# Altium project DB-X01.PrjPcb (part 1 of 5)
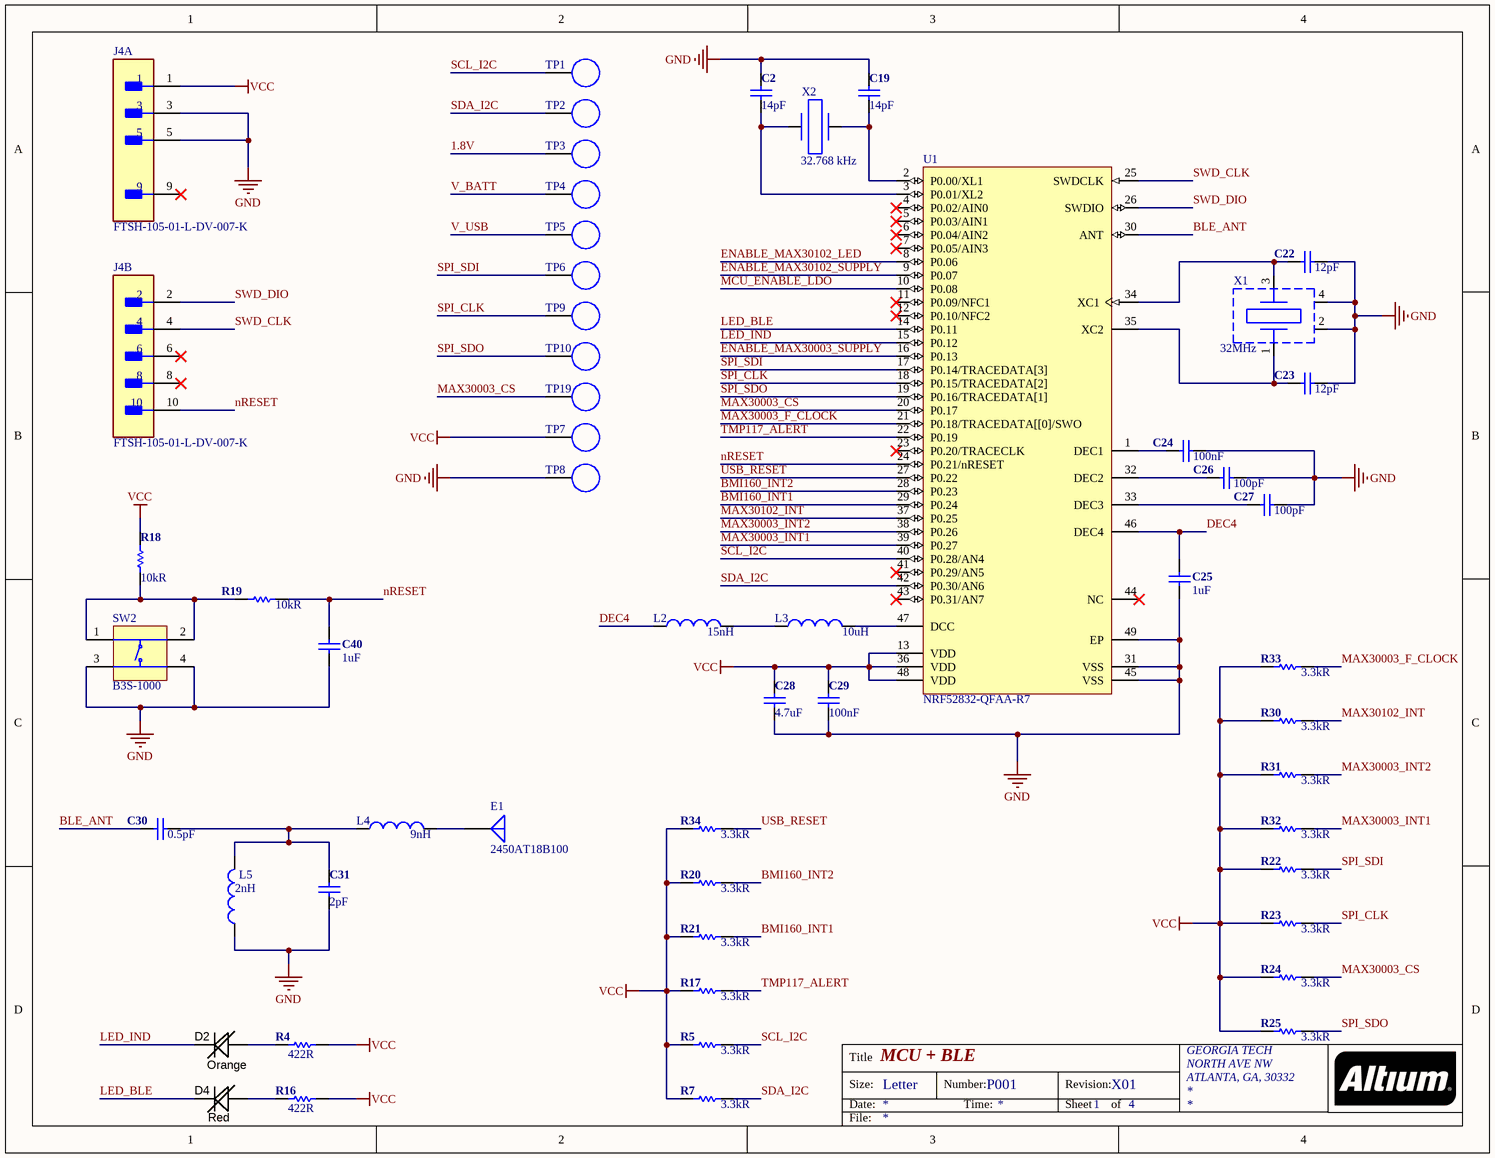
[diagram p0: DB_Main-X01.SchDoc]
Author: C. DEMOLDER
2 sheets, 108 parts. Net scope: global (net labels, ports and power ports of the same name join across sheets).
Board file: DB_Main-X01.PcbDoc
Sheets:
  DB_Main-X01.SchDoc
  DB_Power-X01.SchDoc

## Sheet DB_Main-X01.SchDoc: MCU + BLE
size Letter; Author: C. DEMOLDER; CompanyName: GTBID; DrawnBy: C. DEMOLDER; Engineer: C. DEMOLDER; Organization: GEORGIA TECH; Address1: NORTH AVE NW; Address2: ATLANTA, GA, 30332; DocumentNumber: P001; Revision: X01; SheetNumber: 1; SheetTotal: 4

### Parts
C2  14pF  [C0402]
C19  14pF  [C0402]
C22  12pF  [C0402]
C23  12pF  [C0402]
C24  100nF  [C0402]
C25  1uF  [C0402]
C26  100pF  [C0402]
C27  100pF  [C0402]
C28  4.7uF  [C0402]
C29  100nF  [C0603]
C30  0.5pF  [C0402]
C31  2pF  [C0402]
C40  1uF  [C0402]
D2  Orange  [LED_0402]
D4  Red  [LED_0402]
E1  2450AT18B100  [2450AT18B100]
J4  FTSH-105-01-L-DV-007-K  [FTSH-105-01-L-DV-007-K]  (parts A,B of 2)
L2  15nH  [L0402]
L3  10uH  [L0603]
L4  9nH  [L0402]
L5  2nH  [L0402]
R4  422R  [R0402]
R5  3.3kR  [R0402]
R7  3.3kR  [R0402]
R16  422R  [R0402]
R17  3.3kR  [R0402]
R18  10kR  [R0402]
R19  10kR  [R0402]
R20  3.3kR  [R0402]
R21  3.3kR  [R0402]
R22  3.3kR  [R0402]
R23  3.3kR  [R0402]
R24  3.3kR  [R0402]
R25  3.3kR  [R0402]
R30  3.3kR  [R0402]
R31  3.3kR  [R0402]
R32  3.3kR  [R0402]
R33  3.3kR  [R0402]
R34  3.3kR  [R0402]
SW2  B3S-1000  [OMRON-B3S-1000-4_V]
TP1  S1751-46R  [S1751-46R]  (value not drawn)
TP2  S1751-46R  [S1751-46R]  (value not drawn)
TP3  S1751-46R  [S1751-46R]  (value not drawn)
TP4  S1751-46R  [S1751-46R]  (value not drawn)
TP5  S1751-46R  [S1751-46R]  (value not drawn)
TP6  S1751-46R  [S1751-46R]  (value not drawn)
TP7  S1751-46R  [S1751-46R]  (value not drawn)
TP8  S1751-46R  [S1751-46R]  (value not drawn)
TP9  S1751-46R  [S1751-46R]  (value not drawn)
TP10  S1751-46R  [S1751-46R]  (value not drawn)
TP19  S1751-46R  [S1751-46R]  (value not drawn)
U1  NRF52832-QFAA-R7  [NRF52832-QFAA-R7]
X1  32MHz  [CRYSTAL_1MM6_X_1MM2]
X2  32.768 kHz  [CRYSTAL_1MM2_X_1MM0]

### Nets
GND: C2.1 C19.1 C22.2 C23.2 C24.2 C25.1 C26.2 C27.2 C28.2 C29.1 C31.2 C40.1 J4.3 J4.5 L5.1 SW2.3 SW2.4 TP8.1 U1.31(VSS) U1.45(VSS) U1.49(EP) X1.2(GND) X1.4(GND)
VCC: C28.1 C29.2 J4.1 R4.1 R5.1 R7.1 R16.1 R17.1 R18.1 R20.1 R21.1 R22.1 R23.1 R24.1 R25.1 R30.1 R31.1 R32.1 R33.1 R34.1 TP7.1 U1.13(VDD) U1.36(VDD) U1.48(VDD)
1.8V: TP3.1
BLE_ANT: C30.1 U1.30(ANT)
BMI160_INT1: R21.2 U1.29(P0.24)
BMI160_INT2: R20.2 U1.28(P0.23)
DEC4: C25.2 L2.1 U1.46(DEC4)
ENABLE_MAX30003_SUPPLY: U1.16(P0.13)
ENABLE_MAX30102_LED: U1.8(P0.06)
ENABLE_MAX30102_SUPPLY: U1.9(P0.07)
LED_BLE: D4.K U1.14(P0.11)
LED_IND: D2.K U1.15(P0.12)
MAX30003_CS: R24.2 TP19.1 U1.20(P0.17)
MAX30003_F_CLOCK: R33.2 U1.21(P0.18/TRACEDATA[[0]/SWO)
MAX30003_INT1: R32.2 U1.39(P0.27)
MAX30003_INT2: R31.2 U1.38(P0.26)
MAX30102_INT: R30.2 U1.37(P0.25)
MCU_ENABLE_LDO: U1.10(P0.08)
nRESET: C40.2 J4.10 R19.2 U1.24(P0.21/nRESET)
SCL_I2C: R5.2 TP1.1 U1.40(P0.28/AN4)
SDA_I2C: R7.2 TP2.1 U1.42(P0.30/AN6)
SPI_CLK: R23.2 TP9.1 U1.18(P0.15/TRACEDATA[2])
SPI_SDI: R22.2 TP6.1 U1.17(P0.14/TRACEDATA[3])
SPI_SDO: R25.2 TP10.1 U1.19(P0.16/TRACEDATA[1])
SWD_CLK: J4.4 U1.25(SWDCLK)
SWD_DIO: J4.2 U1.26(SWDIO)
TMP117_ALERT: R17.2 U1.22(P0.19)
USB_RESET: R34.2 U1.27(P0.22)
V_BATT: TP4.1
V_USB: TP5.1
NetC2_2: C2.2 U1.3(P0.01/XL2) X2.1
NetC19_2: C19.2 U1.2(P0.00/XL1) X2.2
NetC22_1: C22.1 U1.34(XC1) X1.3
NetC23_1: C23.1 U1.35(XC2) X1.1
NetC24_1: C24.1 U1.1(DEC1)
NetC26_1: C26.1 U1.32(DEC2)
NetC27_1: C27.1 U1.33(DEC3)
NetC30_2: C30.2 C31.1 L4.1 L5.2
NetD2_A: D2.A R4.2
NetD4_A: D4.A R16.2
NetE1_1: E1.1(A) L4.2
NetL2_2: L2.2 L3.1
NetL3_2: L3.2 U1.47(DCC)
NetR18_2: R18.2 R19.1 SW2.1 SW2.2

Not connected (* = marked no-connect by the designer): J4 6* 8* 9*; U1 4(P0.02/AIN0)* 5(P0.03/AIN1)* 6(P0.04/AIN2)* 7(P0.05/AIN3)* 11(P0.09/NFC1)* 12(P0.10/NFC2)* 23(P0.20/TRACECLK)* 41(P0.29/AN5)* 43(P0.31/AN7)* 44(NC)*

### Notes on the sheet
- Title
- Size:
- Date:
- Letter
- Number:
- Time:
- Revision:
- Sheet
- of
- File: